# Altium schematic sheet 智能马桶综合检测台_数据板V1.0.SchDoc
size A1; PageSetup: Record=PageOptions|CenterHorizontal=True|CenterVertical=True|PrintScale=0.52|XCorrection=1.00|YCorrection=1.00|PrintKind=1|BorderSize=5000000|LeftOffset=0|BottomOffset=0|Orientation=2|PaperLength=2970|PaperWidth=2100|Scale=100|PaperSource=7|PrintQuality=600|MediaType=1|DitherType=10|PaperKind=A4|PrintScaleMode=1
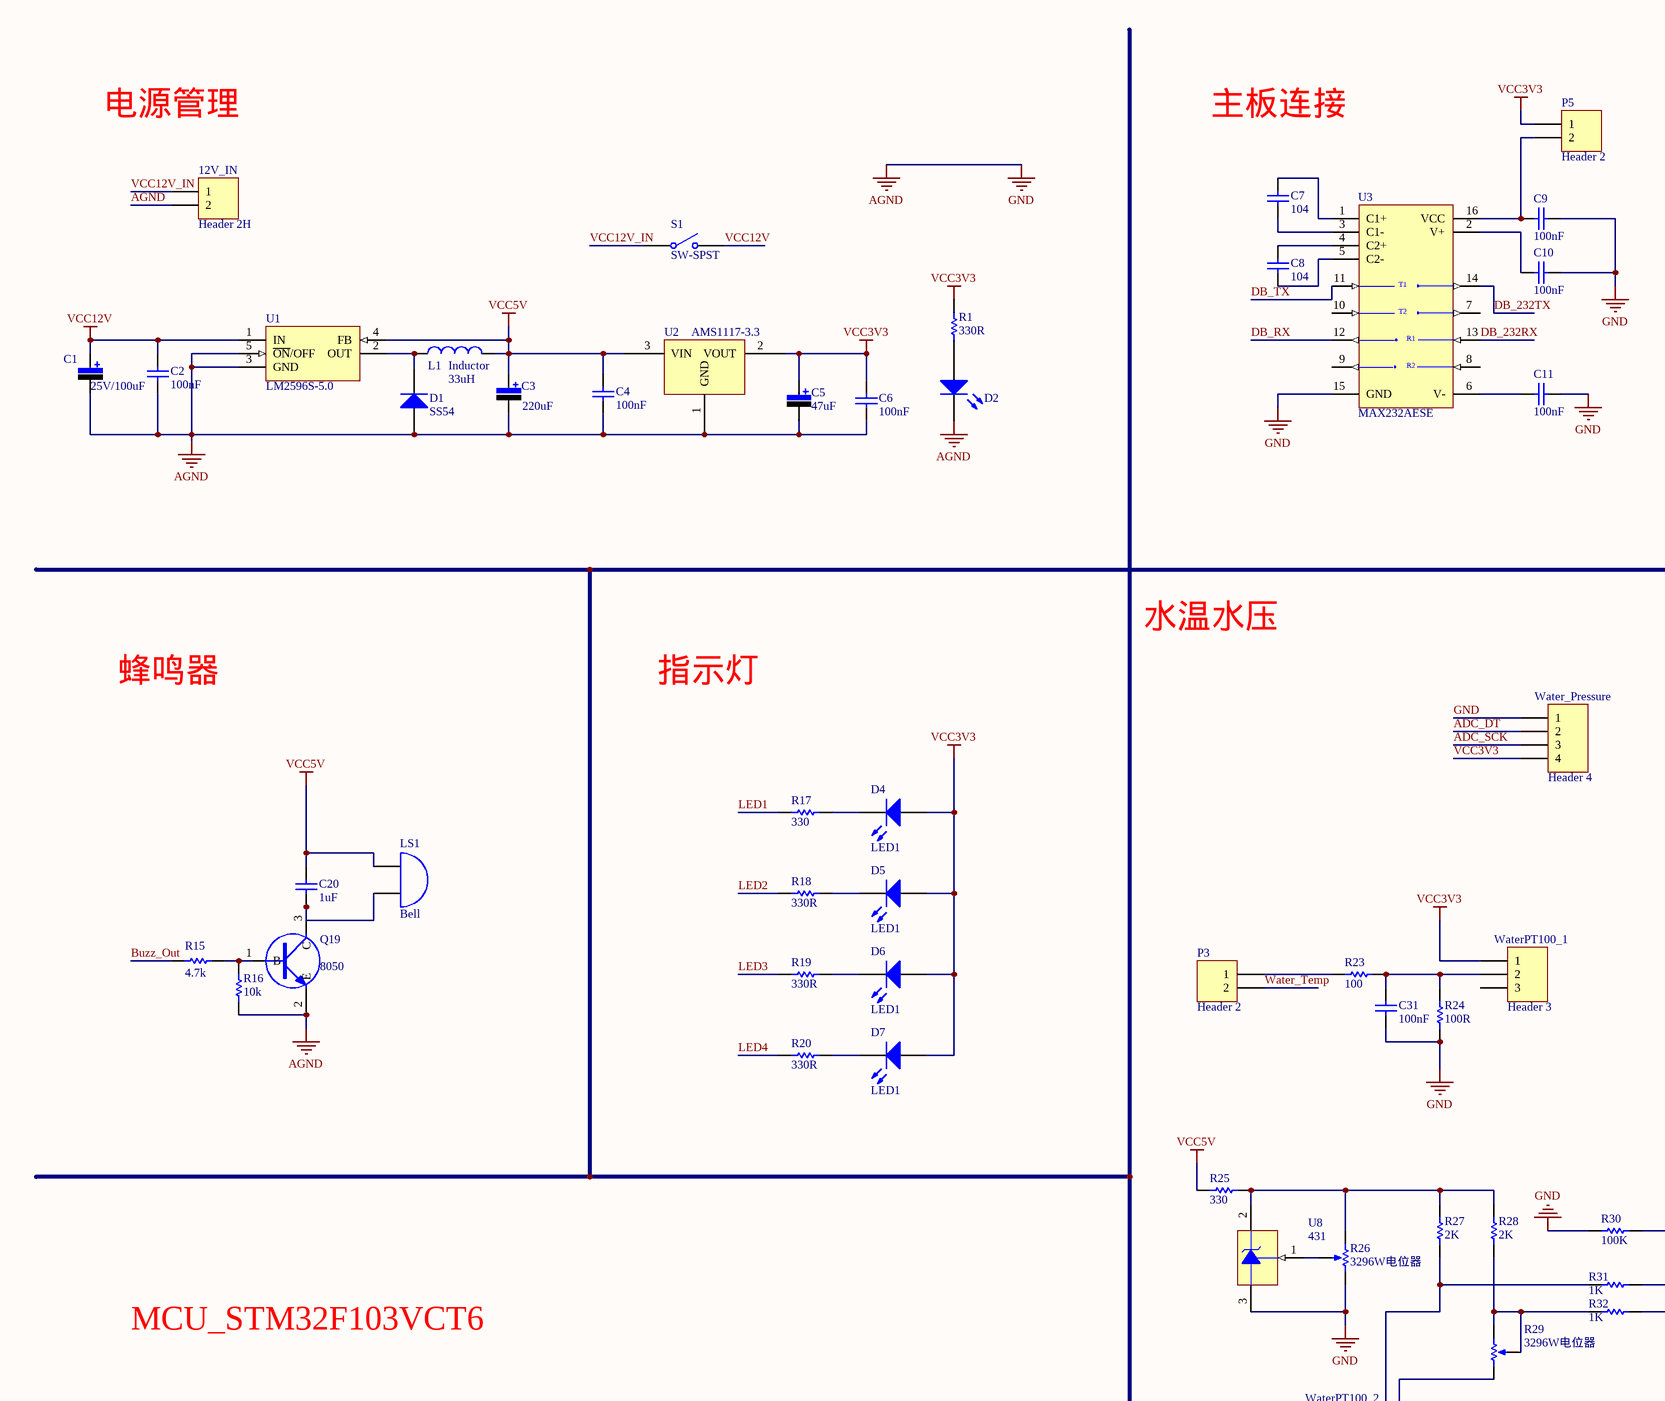
[diagram p0: 智能马桶综合检测台_数据板V1.0.SchDoc, top left]
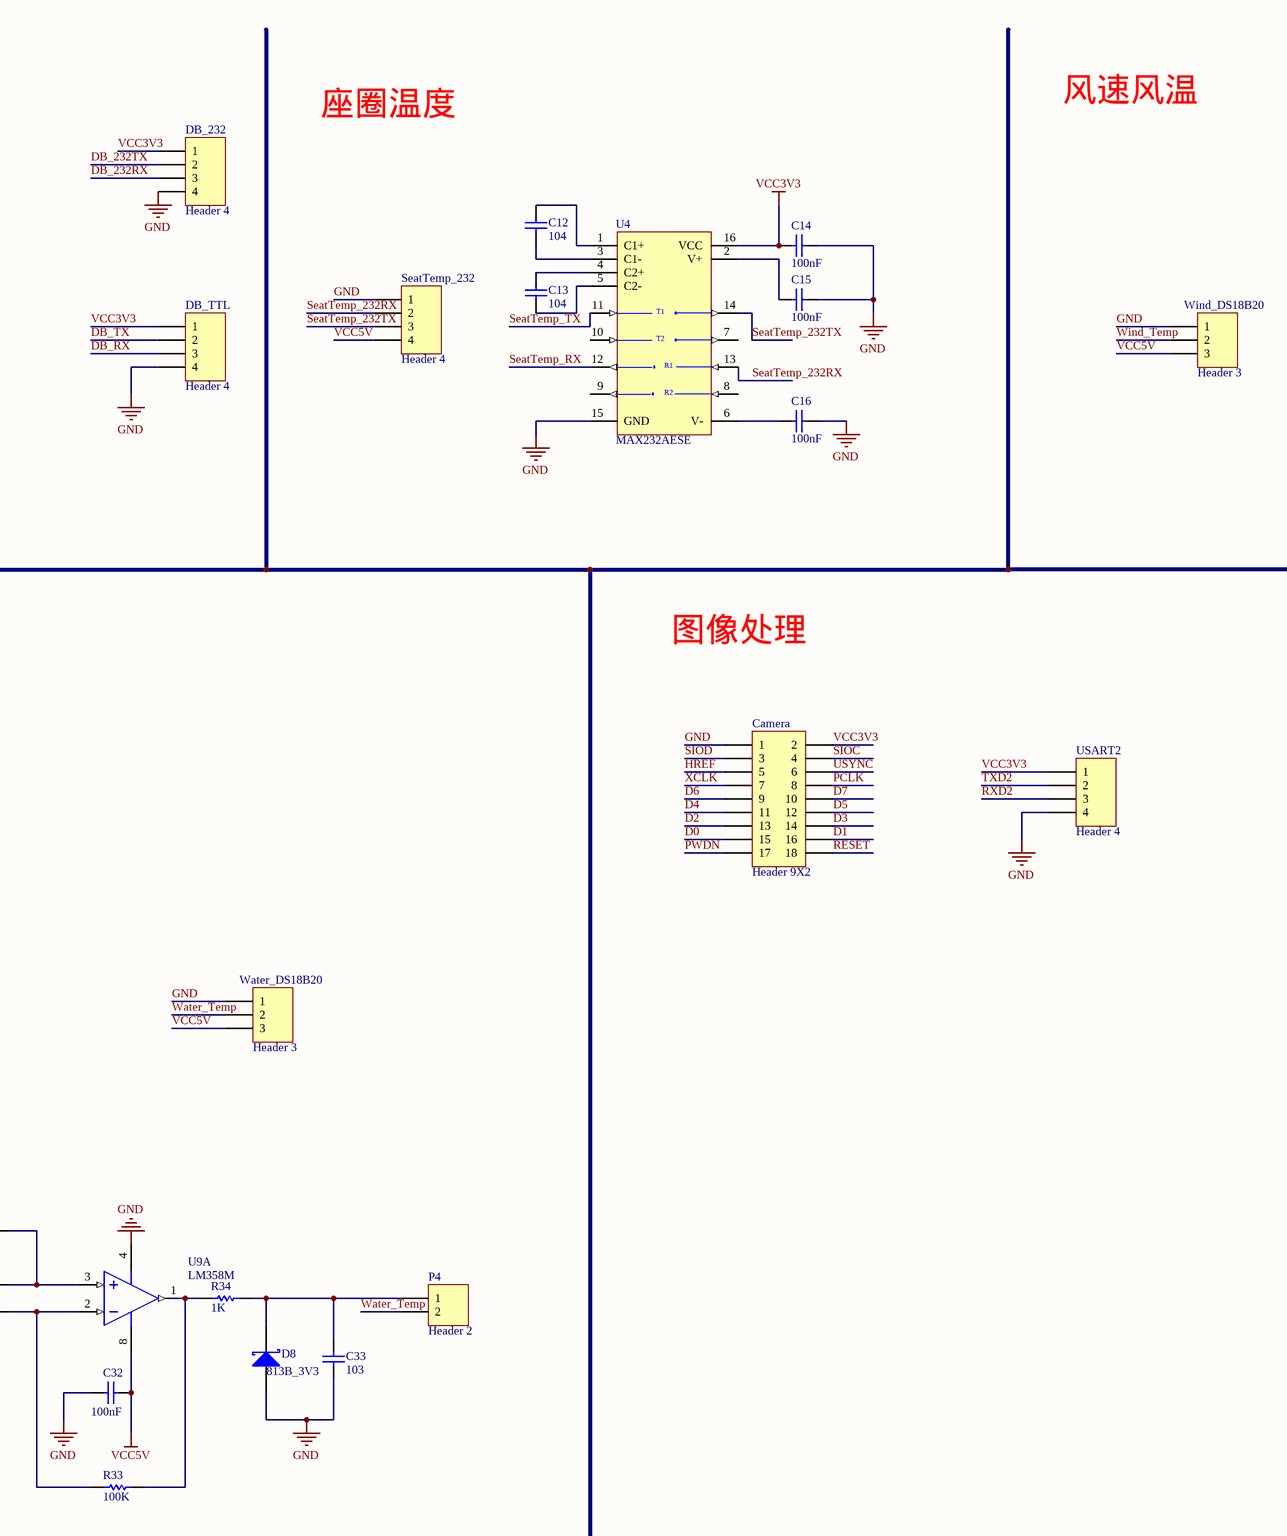
[diagram p1: 智能马桶综合检测台_数据板V1.0.SchDoc, top middle]
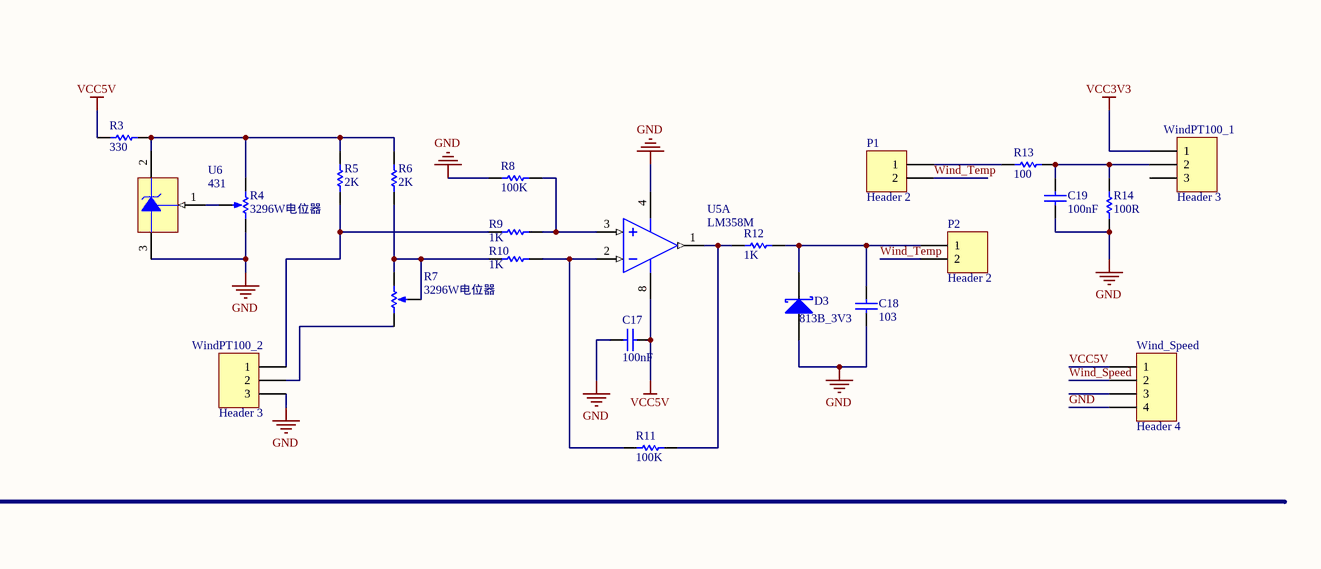
[diagram p2: 智能马桶综合检测台_数据板V1.0.SchDoc, top right]
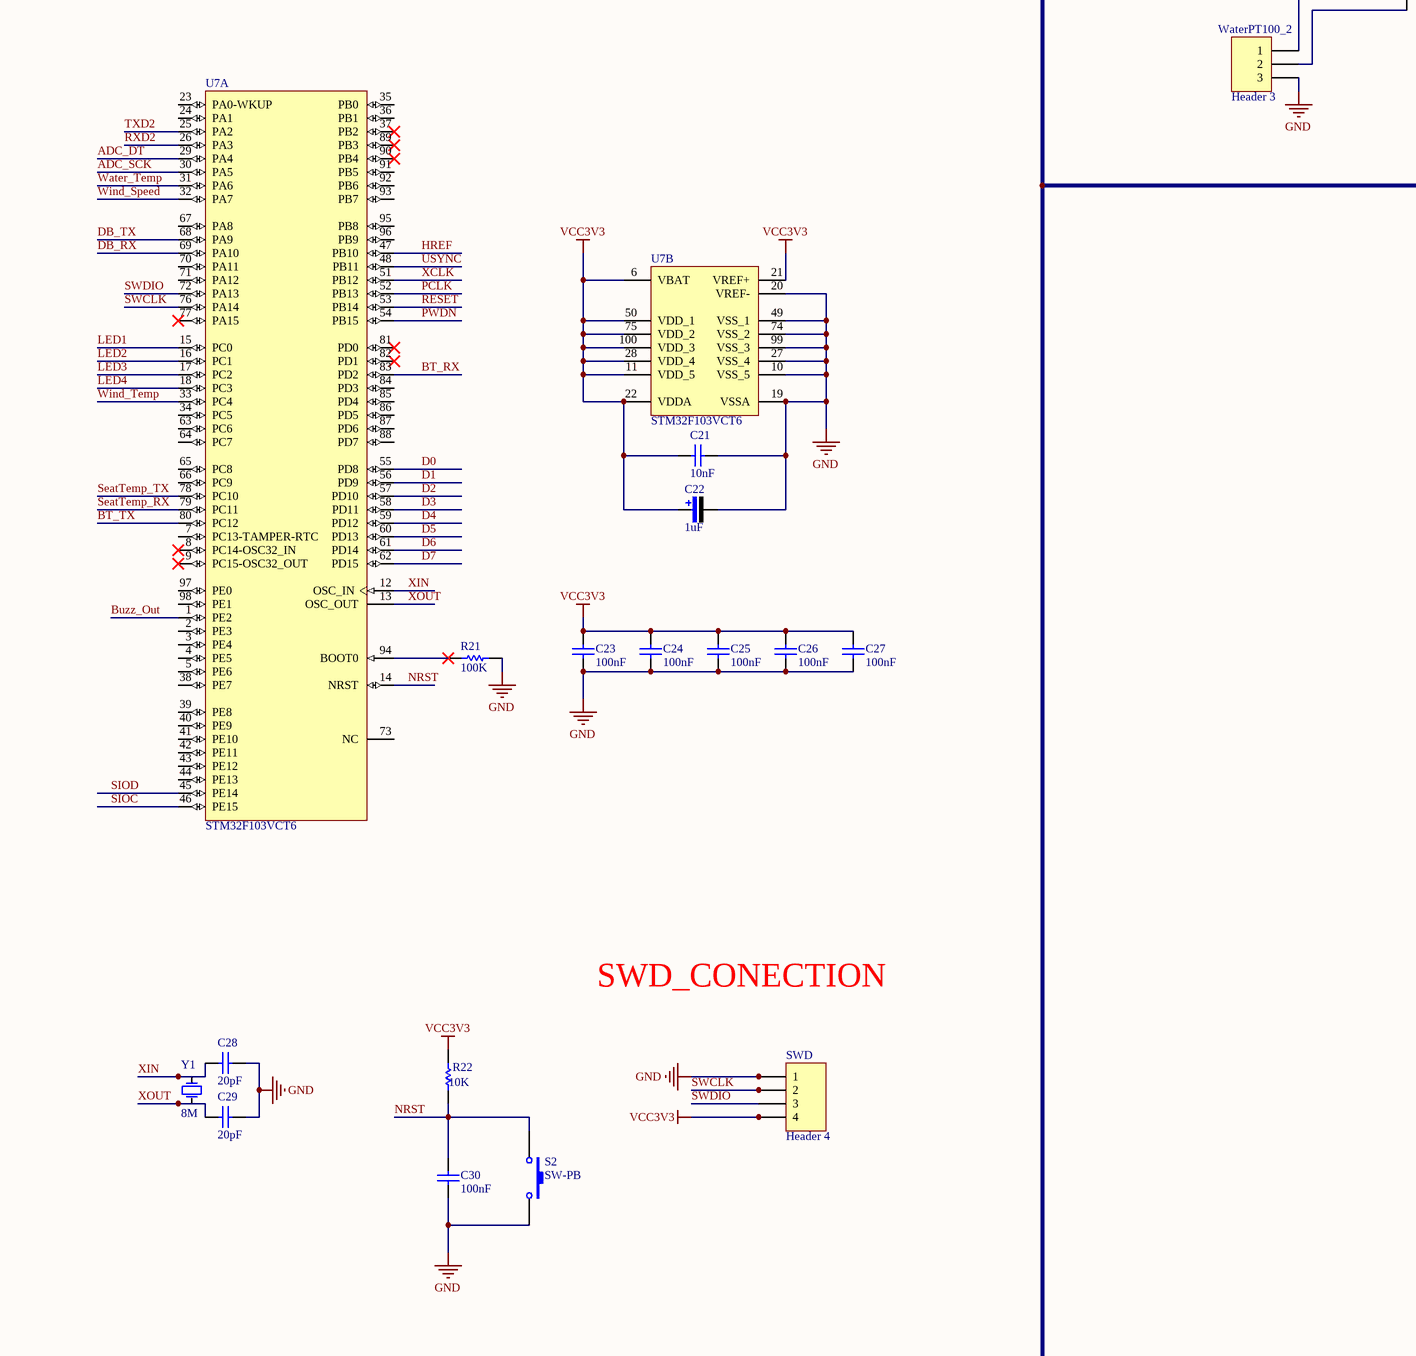
[diagram p3: 智能马桶综合检测台_数据板V1.0.SchDoc, bottom left]

## Parts
12V_IN  Header 2H  [4.2mm接插件2P]
C1  value 25V/100uF  [CC6.56.5]  (hidden comment: Cap Pol)
C2  value 100nF  [CAP-0805]  (hidden comment: Cap)
C3  value 220uF  [CC6.56.5]  (hidden comment: Cap Pol)
C4  value 100nF  [CAP-0805]  (hidden comment: Cap)
C5  value 47uF  [贴片电容5*5.4]  (hidden comment: Cap Pol)
C6  value 100nF  [CAP-0805]  (hidden comment: Cap)
C7  value 104  [CAP-0805]  (hidden comment: Cap)
C8  value 104  [CAP-0805]  (hidden comment: Cap)
C9  value 100nF  [CAP-0805]  (hidden comment: Cap)
C10  value 100nF  [CAP-0805]  (hidden comment: Cap)
C11  value 100nF  [CAP-0805]  (hidden comment: Cap)
C12  value 104  [CAP-0805]  (hidden comment: Cap)
C13  value 104  [CAP-0805]  (hidden comment: Cap)
C14  value 100nF  [CAP-0805]  (hidden comment: Cap)
C15  value 100nF  [CAP-0805]  (hidden comment: Cap)
C16  value 100nF  [CAP-0805]  (hidden comment: Cap)
C17  value 100nF  [CAP-0805]  (hidden comment: Cap)
C18  value 103  [CAP-0805]  (hidden comment: Cap)
C19  value 100nF  [CAP-0805]  (hidden comment: Cap)
C20  value 1uF  [1206]  (hidden comment: Cap)
C21  value 10nF  [CAP-0805]  (hidden comment: Cap)
C22  value 1uF  [1206]  (hidden comment: Cap Pol)
C23  value 100nF  [CAP-0805]  (hidden comment: Cap)
C24  value 100nF  [CAP-0805]  (hidden comment: Cap)
C25  value 100nF  [CAP-0805]  (hidden comment: Cap)
C26  value 100nF  [CAP-0805]  (hidden comment: Cap)
C27  value 100nF  [CAP-0805]  (hidden comment: Cap)
C28  value 20pF  [CAP-0805]  (hidden comment: Cap)
C29  value 20pF  [CAP-0805]  (hidden comment: Cap)
C30  value 100nF  [CAP-0805]  (hidden comment: Cap)
C31  value 100nF  [CAP-0805]  (hidden comment: Cap)
C32  value 100nF  [CAP-0805]  (hidden comment: Cap)
C33  value 103  [CAP-0805]  (hidden comment: Cap)
Camera  Header 9X2  [HDR2X9]
D1  Type: SS54  [SMA]  (hidden comment: Diode)
D2  LED0  [LED_0805]  (value not drawn)
D3  813B_3V3  [SMA]
D4  LED1  [LED_0805]
D5  LED1  [LED_0805]
D6  LED1  [LED_0805]
D7  LED1  [LED_0805]
D8  813B_3V3  [SMA]
DB_232  Header 4  [XH-254-4P]
DB_TTL  Header 4  [XH-254-4P]
L1  Inductor  value 33uH  [功率电感7*7]
LS1  Bell  [有源蜂鸣器5V]
P1  Header 2  [HDR1X2]
P2  Header 2  [HDR1X2]
P3  Header 2  [HDR1X2]
P4  Header 2  [HDR1X2]
P5  Header 2  [HDR1X2]
Q19  8050  [SOT-23_3C]
R1  Res  [0805]  (value not drawn)
R3  Res  [0805]  (value not drawn)
R4  3296W电位器  [VR3296-1]
R5  Res  [0805]  (value not drawn)
R6  Res  [0805]  (value not drawn)
R7  3296W电位器  [VR3296-1]
R8  Res  [0805]  (value not drawn)
R9  Res  [0805]  (value not drawn)
R10  Res  [0805]  (value not drawn)
R11  Res  [0805]  (value not drawn)
R12  Res  [0805]  (value not drawn)
R13  Res  [0805]  (value not drawn)
R14  Res  [0805]  (value not drawn)
R15  Res  [0805]  (value not drawn)
R16  Res  [0805]  (value not drawn)
R17  Res  [0805]  (value not drawn)
R18  Res  [0805]  (value not drawn)
R19  Res  [0805]  (value not drawn)
R20  Res  [0805]  (value not drawn)
R21  Res  [0805]  (value not drawn)
R22  Res  [0805]  (value not drawn)
R23  Res  [0805]  (value not drawn)
R24  Res  [0805]  (value not drawn)
R25  Res  [0805]  (value not drawn)
R26  3296W电位器  [VR3296-1]
R27  Res  [0805]  (value not drawn)
R28  Res  [0805]  (value not drawn)
R29  3296W电位器  [VR3296-1]
R30  Res  [0805]  (value not drawn)
R31  Res  [0805]  (value not drawn)
R32  Res  [0805]  (value not drawn)
R33  Res  [0805]  (value not drawn)
R34  Res  [0805]  (value not drawn)
S1  SW-SPST  [HDR1X2]
S2  SW-PB  [KEY]
SeatTemp_232  Header 4  [XH-254-4P]
SWD  Header 4  [HDR1X4]
U1  LM2596S-5.0  [TO-263-5L(D2PAK)]
U2  AMS1117-3.3  [SOT223]
U3  MAX232AESE  [L16_L]
U4  MAX232AESE  [L16_L]
U5  LM358M  [M08A_N]  (part A of 2)
U6  431
U7  STM32F103VCT6  [STM-LQFP100_N]  (parts A,B of 2)
U8  431
U9  LM358M  [M08A_N]  (part A of 2)
USART2  Header 4  [XH-254-4P]
Water_DS18B20  Header 3  [XH-254-3P-H]
Water_Pressure  Header 4  [XH-254-4P]
WaterPT100_1  Header 3  [XH-254-3P-H]
WaterPT100_2  Header 3  [XH-254-3P-H]
Wind_DS18B20  Header 3  [XH-254-3P-H]
Wind_Speed  Header 4  [USB-4-A-SMT]
WindPT100_1  Header 3  [XH-254-3P-H]
WindPT100_2  Header 3  [XH-254-3P-H]
Y1  value 8M  [X-HC49U]  (hidden comment: XTAL)

## Nets
AGND: 12V_IN.2 C1.2 C2.1 C3.2 C4.1 C5.2 C6.1 C9.1 C10.1 C11.1 C14.1 C15.1 C16.1 C17.2 C18.1 C19.2 C21.1 C22.2 C23.2 C24.2 C25.2 C26.2 C27.2 C28.1 C29.1 C30.2 C31.2 C32.2 C33.1 Camera.1 D1.1(A) D2.2(K) D3.1(A) D8.1(A) DB_232.4 DB_TTL.4 Q19.2(E) R4.2(BOT) R8.2 R14.1 R16.2 R21.2 R24.1 R26.2(BOT) R30.2 S2.2 SeatTemp_232.1 SWD.1 U1.3(GND) U1.5(~{ON}/OFF) U2.1(GND) U3.15(GND) U4.15(GND) U5.4(GND) U6.3(A) U7.10(VSS_5) U7.19(VSSA) U7.20(VREF-) U7.27(VSS_4) U7.49(VSS_1) U7.74(VSS_2) U7.99(VSS_3) U8.3(A) U9.4(GND) USART2.4 Water_DS18B20.1 Water_Pressure.1 WaterPT100_2.3 Wind_DS18B20.1 Wind_Speed.4 WindPT100_2.3  [also labelled GND]
VCC3V3: C5.1 C6.2 C14.2 C21.2 C22.1 C23.1 C24.1 C25.1 C26.1 C27.1 Camera.2 D4.1(A) D5.1(A) D6.1(A) D7.1(A) DB_232.1 DB_TTL.1 P5.1 R1.2 R22.2 SWD.4 U2.2(VOUT) U4.16(VCC) U7.6(VBAT) U7.11(VDD_5) U7.21(VREF+) U7.22(VDDA) U7.28(VDD_4) U7.50(VDD_1) U7.75(VDD_2) U7.100(VDD_3) USART2.1 Water_Pressure.4 WaterPT100_1.1 WindPT100_1.1
VCC5V: C3.1 C4.2 C17.1 C20.2 C32.1 L1.2 LS1.1(A) R3.2 R25.2 SeatTemp_232.4 U1.4(FB) U2.3(VIN) U5.8(V+) U9.8(V+) Water_DS18B20.3 Wind_DS18B20.3 Wind_Speed.1
VCC12V: C1.1 C2.2 S1.2(NO) U1.1(IN)
ADC_DT: U7.29(PA4) Water_Pressure.2
ADC_SCK: U7.30(PA5) Water_Pressure.3
BT_RX: U7.83(PD2)
BT_TX: U7.80(PC12)
Buzz_Out: R15.1 U7.1(PE2)
D0: Camera.15 U7.55(PD8)
D1: Camera.16 U7.56(PD9)
D2: Camera.13 U7.57(PD10)
D3: Camera.14 U7.58(PD11)
D4: Camera.11 U7.59(PD12)
D5: Camera.12 U7.60(PD13)
D6: Camera.9 U7.61(PD14)
D7: Camera.10 U7.62(PD15)
DB_232RX: DB_232.3 U3.13(R1IN)
DB_232TX: DB_232.2 U3.14(T1OUT)
DB_RX: DB_TTL.3 U3.12(R1OUT) U7.69(PA10)
DB_TX: DB_TTL.2 U3.11(T1IN) U7.68(PA9)
HREF: Camera.5 U7.47(PB10)
LED1: R17.1 U7.15(PC0)
LED2: R18.1 U7.16(PC1)
LED3: R19.1 U7.17(PC2)
LED4: R20.1 U7.18(PC3)
NRST: C30.1 R22.1 S2.1 U7.14(NRST)
PCLK: Camera.8 U7.52(PB13)
PWDN: Camera.17 U7.54(PB15)
RESET: Camera.18 U7.53(PB14)
RXD2: U7.26(PA3) USART2.3
SeatTemp_232RX: SeatTemp_232.2 U4.13(R1IN)
SeatTemp_232TX: SeatTemp_232.3 U4.14(T1OUT)
SeatTemp_RX: U4.12(R1OUT) U7.79(PC11)
SeatTemp_TX: U4.11(T1IN) U7.78(PC10)
SIOC: Camera.4 U7.46(PE15)
SIOD: Camera.3 U7.45(PE14)
SWCLK: SWD.2 U7.76(PA14)
SWDIO: SWD.3 U7.72(PA13)
TXD2: U7.25(PA2) USART2.2
USYNC: Camera.6 U7.48(PB11)
VCC12V_IN: 12V_IN.1 S1.1(COMMON)
Water_Temp: P3.2 P4.2 U7.31(PA6) Water_DS18B20.2
Wind_Speed: U7.32(PA7) Wind_Speed.2
Wind_Temp: P1.2 P2.2 U7.33(PC4) Wind_DS18B20.2
XCLK: Camera.7 U7.51(PB12)
XIN: C28.2 U7.12(OSC_IN) Y1.1(OSC1)
XOUT: C29.2 U7.13(OSC_OUT) Y1.2(OSC2)
NetC7_1: C7.1 U3.1(C1+)
NetC7_2: C7.2 U3.3(C1-)
NetC8_1: C8.1 U3.4(C2+)
NetC8_2: C8.2 U3.5(C2-)
NetC9_2: C9.2 P5.2 U3.16(VCC)
NetC10_2: C10.2 U3.2(V+)
NetC11_2: C11.2 U3.6(V-)
NetC12_1: C12.1 U4.1(C1+)
NetC12_2: C12.2 U4.3(C1-)
NetC13_1: C13.1 U4.4(C2+)
NetC13_2: C13.2 U4.5(C2-)
NetC15_2: C15.2 U4.2(V+)
NetC16_2: C16.2 U4.6(V-)
NetC18_2: C18.2 D3.2(K) P2.1 R12.1
NetC19_1: C19.1 R13.1 R14.2 WindPT100_1.2
NetC20_1: C20.1 LS1.2(B) Q19.3(C)
NetC31_1: C31.1 R23.1 R24.2 WaterPT100_1.2
NetC33_2: C33.2 D8.2(K) P4.1 R34.1
NetD1_2: D1.2(K) L1.1 U1.2(OUT)
NetD2_1: D2.1(A) R1.1
NetD4_2: D4.2(K) R17.2
NetD5_2: D5.2(K) R18.2
NetD6_2: D6.2(K) R19.2
NetD7_2: D7.2(K) R20.2
NetP1_1: P1.1 R13.2
NetP3_1: P3.1 R23.2
NetQ19_1: Q19.1(B) R15.2 R16.1
NetR3_1: R3.1 R4.1(TOP) R5.2 R6.2 U6.2(K)
NetR4_W: R4.W(TAP) U6.1(REF)
NetR5_1: R5.1 R9.2 WindPT100_2.1
NetR6_1: R6.1 R7.2(BOT) R7.W(TAP) R10.2
NetR7_1: R7.1(TOP) WindPT100_2.2
NetR8_1: R8.1 R9.1 U5.3(IN+)
NetR10_1: R10.1 R11.2 U5.2(IN-)
NetR11_1: R11.1 R12.2 U5.1(OUT)
NetR21_1: R21.1 U7.94(BOOT0)
NetR25_1: R25.1 R26.1(TOP) R27.2 R28.2 U8.2(K)
NetR26_W: R26.W(TAP) U8.1(REF)
NetR27_1: R27.1 R31.2 WaterPT100_2.1
NetR28_1: R28.1 R29.2(BOT) R29.W(TAP) R32.2
NetR29_1: R29.1(TOP) WaterPT100_2.2
NetR30_1: R30.1 R31.1 U9.3(IN+)
NetR32_1: R32.1 R33.2 U9.2(IN-)
NetR33_1: R33.1 R34.2 U9.1(OUT)

Not connected (* = marked no-connect by the designer): U3 7(T2OUT) 8(R2IN) 9(R2OUT) 10(T2IN); U4 7(T2OUT) 8(R2IN) 9(R2OUT) 10(T2IN); U7 2(PE3) 3(PE4) 4(PE5) 5(PE6) 7(PC13-TAMPER-RTC) 8(PC14-OSC32_IN)* 9(PC15-OSC32_OUT)* 23(PA0-WKUP) 24(PA1) 34(PC5) 35(PB0) 36(PB1) 37(PB2)* 38(PE7) 39(PE8) 40(PE9) 41(PE10) 42(PE11) 43(PE12) 44(PE13) 63(PC6) 64(PC7) 65(PC8) 66(PC9) 67(PA8) 70(PA11) 71(PA12) 73(NC) 77(PA15)* 81(PD0)* 82(PD1)* 84(PD3) 85(PD4) 86(PD5) 87(PD6) 88(PD7) 89(PB3)* 90(PB4)* 91(PB5) 92(PB6) 93(PB7) 95(PB8) 96(PB9) 97(PE0) 98(PE1); WaterPT100_1 3; Wind_Speed 3; WindPT100_1 3

## Notes on the sheet
- 电源管理
- 主板连接
- 座圈温度
- 风速风温
- 水温水压
- 图像处理
- 蜂鸣器
- 指示灯
- MCU_STM32F103VCT6
- SWD_CONECTION
- (in symbol MAX232AESE) T1; T2; R1; R2
- (in symbol Res1) 330R; 10k; 4.7k; 330; 10K; 100K; 100R; 100; 2K; 1K

## Library data of the parts
12V_IN = Header 2H: Header, 2-Pin, Right Angle; LatestRevisionDate: 17-Jul-2002; LatestRevisionNote: Re-released for DXP Platform.; Publisher: Altium Limited
C1 C3 C5 C22 = Cap Pol: 极性电解电容; Vol: 16V; Published: 8-Jun-2000; LatestRevisionDate: 17-Jul-2002; LatestRevisionNote: Re-released for DXP Platform.; PackageReference: RB7.6-15; Publisher: Altium Limited
C2 C4 C6-C21 C23-C33 = Cap: 无极性电容; Published: 8-Jun-2000; LatestRevisionDate: 17-Jul-2002; LatestRevisionNote: Re-released for DXP Platform.; PackageReference: RAD-0.3; Publisher: Altium Limited
Camera = Header 9X2: Header, 9-Pin, Dual row; LatestRevisionDate: 17-Jul-2002; LatestRevisionNote: Re-released for DXP Platform.; Publisher: Altium Limited
D1 = Diode: 二极管; Published: 8-Jun-2000; LatestRevisionDate: 17-Jul-2002; LatestRevisionNote: Re-released for DXP Platform.; PackageDocument: Sep-1996; PackageReference: SMC; Publisher: Altium Limited; Code_JEDEC: DO-214-AB
D2 = LED0: 发光二极管; Published: 8-Jun-2000; LatestRevisionDate: 08-Jul-2005; LatestRevisionNote: Mech Layer 1 removed.; PackageReference: LED-0; Publisher: Altium Limited
D3 D8 = Diode 11DQ03: Schottky Rectifier; Published: 8-Jun-2000; LatestRevisionDate: 17-Jul-2002; LatestRevisionNote: Re-released for DXP Platform.; DatasheetDocument: Dec-1997; PackageReference: DO-204AL; Publisher: Altium Limited; Code_JEDEC: DO-204-AL; ComponentLink1Description: Manufacturer Link; ComponentLink1URL: http://www.irf.com/; ComponentLink2Description: Datasheet; ComponentLink2URL: http://www.irf.com/product-info/datasheets/data/11dq03.pdf
D4-D7 = LED1: Typical RED GaAs LED; Published: 8-Jun-2000; LatestRevisionDate: 08-Jul-2005; LatestRevisionNote: Mech Layer 1 removed.; PackageReference: LED-1; Publisher: Altium Limited
DB_232 DB_TTL SeatTemp_232 SWD USART2 Water_Pressure Wind_Speed = Header 4: Header, 4-Pin; LatestRevisionDate: 17-Jul-2002; LatestRevisionNote: Re-released for DXP Platform.; Publisher: Altium Limited
L1 = Inductor: Code_IEC: 1005; Published: 8-Jun-2000; LatestRevisionDate: 17-Jul-2002; LatestRevisionNote: Re-released for DXP Platform.; PackageReference: 0402-A; Publisher: Altium Limited; Code_JEITA: 0402
LS1 = Bell: Electrical Bell; Published: 24-Mar-1999; LatestRevisionDate: 17-Jul-2002; LatestRevisionNote: Re-released for DXP Platform.; PackageReference: PIN2; Publisher: Altium Limited
P1-P5 = Header 2: Header, 2-Pin; LatestRevisionDate: 17-Jul-2002; LatestRevisionNote: Re-released for DXP Platform.; Publisher: Altium Limited
Q19 = NPN(1)
R1 R3 R5 R6 R8-R25 R27 R28 R30-R34 = Res1: 贴片电阻; Published: 8-Jun-2000; LatestRevisionDate: 17-Jul-2002; LatestRevisionNote: Re-released for DXP Platform.; PackageReference: AXIAL-0.4; Publisher: Altium Limited
S1 = SW-SPST: Single-Pole, Single-Throw Switch; Published: 24-Mar-1999; LatestRevisionDate: 17-Jul-2002; LatestRevisionNote: Re-released for DXP Platform.; PackageReference: SPST-2; Publisher: Altium Limited
S2 = SW-PB: Switch; Published: 24-Mar-1999; LatestRevisionDate: 17-Jul-2002; LatestRevisionNote: Re-released for DXP Platform.; PackageReference: SPST-2; Publisher: Altium Limited
U1 = LM2596S-5.0: Simple Switcher Power Converter 150 kHz 3A Step Down Voltage Regulator; Note: Tab is connected to GND; Published: 15-Apr-2002; DatasheetVersion: Dec-1997; PackageReference: TS5B; Publisher: Altium Limited; PackageDescription: D2-PAK; 5 Leads; Body 14.4 (inc. leads) x 10.4 mm (LxW max); ComponentLink1Description: Manufacturer Link; ComponentLink1URL: http://www.national.com/; ComponentLink2Description: Datasheet; ComponentLink2URL: http://www.national.com/ds.cgi/LM/LM2596.pdf; ComponentLink3Description: URL Link1; ComponentLink3URL: http://www.national.com/pf/LM/LM2596.html
U2 = AS1117
U3 U4 = MAX232AESE: +5V-Powered, Multichannel RS-232 Driver/Receiver; Published: 16-Jan-2001; LatestRevisionDate: 13-Apr-2006; LatestRevisionNote: IPC-7351 Footprint Added.; DatasheetVersion: Nov-1997; PackageReference: NSO16; Publisher: Altium Limited; PackageDescription: 16-Pin Small Outline Integrated Circuit 1.27 mm Pitch; Code_JEDEC: MS-012-AC; Code_IPC: SOIC127P600-16; ComponentLink1Description: Manufacturer Link; ComponentLink1URL: http://www.maxim-ic.com/; ComponentLink2Description: Datasheet; ComponentLink2URL: http://pdfserv.maxim-ic.com/en/ds/MAX220-MAX249.pdf
U5 U9 = LM358M: Low-Power Dual Operational Amplifier; Published: 15-Apr-2002; LatestRevisionDate: 13-Apr-2006; LatestRevisionNote: IPC-7351 Footprint Added.; DatasheetVersion: Sep-1999; PackageVersion: Sep-1997; PackageReference: M08A; Publisher: Altium Limited; PackageDescription: 8-Pin Small Outline Integrated Circuit 1.27 mm Pitch; Code_JEDEC: MS-012-AA; Code_IPC: SOIC127P600-8; ComponentLink1Description: Manufacturer Link; ComponentLink1URL: http://www.national.com/; ComponentLink2Description: Datasheet; ComponentLink2URL: http://www.national.com/ds.cgi/LM/LM158.pdf; ComponentLink3Description: URL Link1; ComponentLink3URL: http://www.national.com/pf/LM/LM358.html
U7 = STM32F103VCT6: ARM Cortex-M3 32-bit MCU, 256 KB Flash, 48 KB Internal RAM, 80 I/Os, 100-pin LQFP, -40 to 85 degC, Tray; A/D Converter: 3x12-bit (16 Channel); D/A Converter: 2x12-bit (2 Channel); FLASH Size (Prog) (kB): 256; I/Os (High Current): 80; Internal RAM Size (kB): 48; Operating Frequency(F) (Processor speed) (MHz): 72; Supply Voltage(Vcc) min (V): 2; DatasheetVersion: Rev. 8; PackageVersion: Rev. 1, 06/2013; PackageReference: LQFP100; PackageDescription: 100-Pin Low Profile Quad Flat Package, 14 x 14 mm Body, 0.5 mm Pitch; Supplier 1: Digi-Key; Supplier Part Number 1: 497-9034-ND; Supplier 2: Farnell; Supplier Part Number 2: 1624139; Supplier 3: Newark; Supplier Part Number 3: 57P1255; Supplier 4: Mouser; Supplier Part Number 4: 511-STM32F103VCT6; Core: ARM Cortex-M3; Packing: Tray; Mounting Technology: Surface Mount; PartNumber: STM32F103VCT6; ComponentLink1Description: Manufacturer URL; ComponentLink1URL: http://www.st.com/web/en/home.html; ComponentLink2Description: Datasheet; ComponentLink2URL: http://www.st.com/st-web-ui/static/active/en/resource/technical/document/datasheet/CD00191185.pdf; ComponentLink3Description: Package Specification; ComponentLink3URL: http://www.st.com/st-web-ui/static/active/en/resource/technical/document/data_brief/DM00071938.pdf
Water_DS18B20 WaterPT100_1 WaterPT100_2 Wind_DS18B20 WindPT100_1 WindPT100_2 = Header 3: Header, 3-Pin; LatestRevisionDate: 17-Jul-2002; LatestRevisionNote: Re-released for DXP Platform.; Publisher: Altium Limited
Y1 = XTAL: 晶振; Published: 8-Jun-2000; LatestRevisionDate: 17-Jul-2002; LatestRevisionNote: Re-released for DXP Platform.; PackageReference: R38; Publisher: Altium Limited